# Altium schematic sheet imu.SchDoc
size A
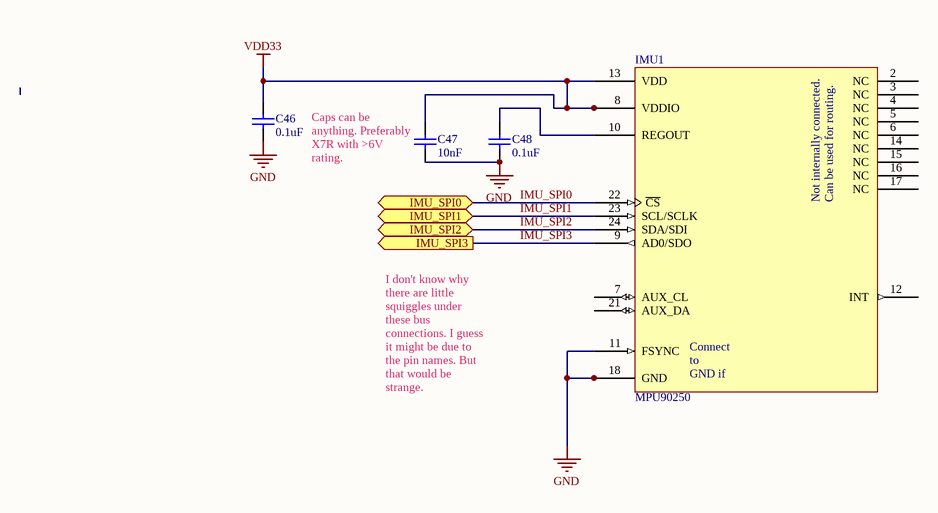
[diagram p0: imu.SchDoc]

## Parts
C46  value 0.1uF  [Cap_0402]  (hidden comment: Cap)
C47  value 10nF  [Cap_0402]  (hidden comment: Cap)
C48  value 0.1uF  [Cap_0402]  (hidden comment: Cap)
IMU1  MPU90250  [QFN24-3x3mm]

## Ports
IMU_SPI0 (bidir), IMU_SPI1 (bidir), IMU_SPI2 (bidir), IMU_SPI3 (out)

## Nets
GND: C46.2 C47.2 C48.2 IMU1.11(FSYNC) IMU1.18(GND) IMU1.20(RESV)
VDD33: C46.1 C47.1 IMU1.1(RESV) IMU1.8(VDDIO) IMU1.13(VDD)
IMU_SPI0: IMU1.22(~{CS}) ; port IMU_SPI0
IMU_SPI1: IMU1.23(SCL/SCLK) ; port IMU_SPI1
IMU_SPI2: IMU1.24(SDA/SDI) ; port IMU_SPI2
IMU_SPI3: IMU1.9(AD0/SDO) ; port IMU_SPI3
NetC48_1: C48.1 IMU1.10(REGOUT)

Not connected (* = marked no-connect by the designer): IMU1 2(NC) 3(NC) 4(NC) 5(NC) 6(NC) 7(AUX_CL) 12(INT) 14(NC) 15(NC) 16(NC) 17(NC) 19(DO_NOT_CONNECT) 21(AUX_DA)

## Notes on the sheet
- (near C47) Caps can be anything. Preferably X7R with >6V rating.
- I don't know why there are little squiggles under these bus connections. I guess it might be due to the pin names. But that would be strange.
- (in symbol MPU90250) Not internally connected.; Can be used for routing.; Connect to / GND if / not in use

## Library data of the parts
C46-C48 = Cap: Capacitor; Published: 8-Jun-2000; LatestRevisionDate: 17-Jul-2002; LatestRevisionNote: Re-released for DXP Platform.; PackageReference: RAD-0.3; Publisher: Altium Limited; PackageDescription: Radial Cap, Thru-Hole; 2 Leads; 0.3 in Pin Spacing
IMU1 = MPU90250: 9-Axis IMU (Accel, Gyro, Magno)